# Altium schematic sheet ST1-100-Top.SchDoc: Top
size A3; SheetNumber: 1; SheetTotal: 1
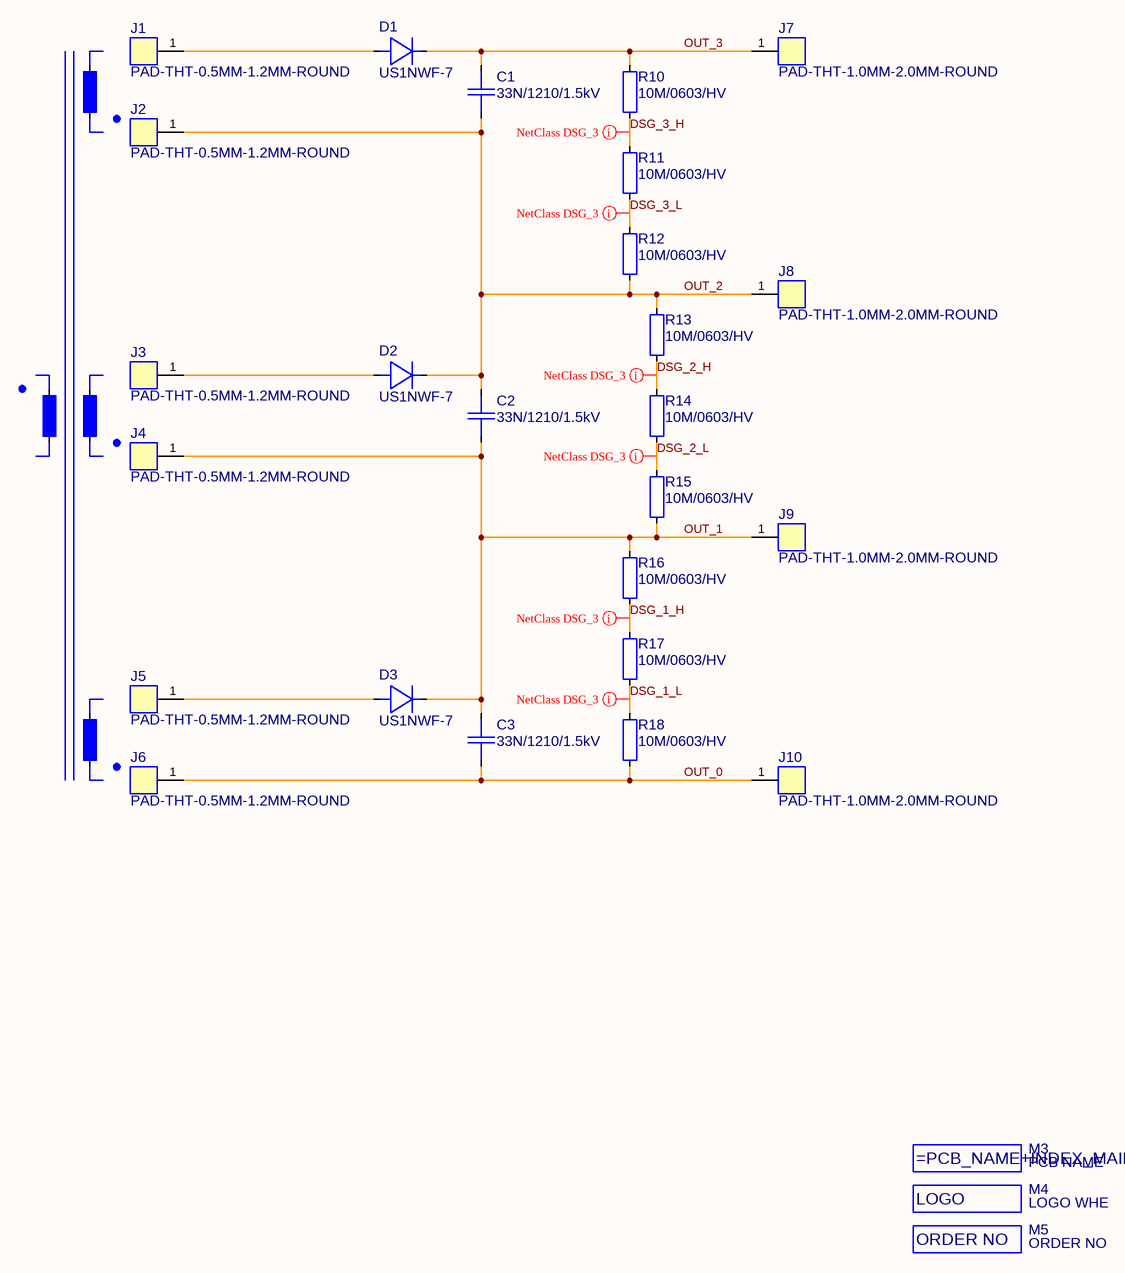
[diagram p0: ST1-100-Top.SchDoc]

## Parts
C1  33N/1210/1.5kV  [CAP1210_X7R]
C2  33N/1210/1.5kV  [CAP1210_X7R]
C3  33N/1210/1.5kV  [CAP1210_X7R]
D1  US1NWF-7  [SOD3718X125]
D2  US1NWF-7  [SOD3718X125]
D3  US1NWF-7  [SOD3718X125]
J1  PAD-THT-0.5MM-1.2MM-ROUND  [PAD-THT-0.5MM-1.2MM-ROUND]
J2  PAD-THT-0.5MM-1.2MM-ROUND  [PAD-THT-0.5MM-1.2MM-ROUND]
J3  PAD-THT-0.5MM-1.2MM-ROUND  [PAD-THT-0.5MM-1.2MM-ROUND]
J4  PAD-THT-0.5MM-1.2MM-ROUND  [PAD-THT-0.5MM-1.2MM-ROUND]
J5  PAD-THT-0.5MM-1.2MM-ROUND  [PAD-THT-0.5MM-1.2MM-ROUND]
J6  PAD-THT-0.5MM-1.2MM-ROUND  [PAD-THT-0.5MM-1.2MM-ROUND]
J7  PAD-THT-1.0MM-2.0MM-ROUND  [PAD-THT-1.0MM-2.0MM-ROUND]
J8  PAD-THT-1.0MM-2.0MM-ROUND  [PAD-THT-1.0MM-2.0MM-ROUND]
J9  PAD-THT-1.0MM-2.0MM-ROUND  [PAD-THT-1.0MM-2.0MM-ROUND]
J10  PAD-THT-1.0MM-2.0MM-ROUND  [PAD-THT-1.0MM-2.0MM-ROUND]
L1  22UH\7643  (value not drawn)  (graphical)
L2  22UH\7643  (value not drawn)  (graphical)
L3  22UH\7643  (value not drawn)  (graphical)
L4  22UH\7643  (value not drawn)  (graphical)
M3  PCB NAME  [PCB-NAME-2MM-CENTER]
M4  LOGO WHE  [LOGO-WHE-2MM]
M5  ORDER NO  [JLC-ORDER]
R10  10M/0603/HV  [R0603-0.40-WW]
R11  10M/0603/HV  [R0603-0.40-WW]
R12  10M/0603/HV  [R0603-0.40-WW]
R13  10M/0603/HV  [R0603-0.40-WW]
R14  10M/0603/HV  [R0603-0.40-WW]
R15  10M/0603/HV  [R0603-0.40-WW]
R16  10M/0603/HV  [R0603-0.40-WW]
R17  10M/0603/HV  [R0603-0.40-WW]
R18  10M/0603/HV  [R0603-0.40-WW]

## Nets
DSG_1_H: R16.2 R17.1
DSG_1_L: R17.2 R18.1
DSG_2_H: R13.2 R14.1
DSG_2_L: R14.2 R15.1
DSG_3_H: R10.2 R11.1
DSG_3_L: R11.2 R12.1
OUT_0: C3.2 J6.1 J10.1 R18.2
OUT_1: C2.2 C3.1 D3.1(C) J4.1 J9.1 R15.2 R16.1
OUT_2: C1.2 C2.1 D2.1(C) J2.1 J8.1 R12.2 R13.1
OUT_3: C1.1 D1.1(C) J7.1 R10.1
NetD1_2: D1.2(A) J1.1
NetD2_2: D2.2(A) J3.1
NetD3_2: D3.2(A) J5.1

Not connected (* = marked no-connect by the designer): L1 1 2; L2 1 2; L3 1 2; L4 1 2

## Layout directives
net class DSG_3: DSG_1_H, DSG_1_L, DSG_2_H, DSG_2_L, DSG_3_H, DSG_3_L

## Notes on the sheet
- Date:
- Size:
- A3
- Schema:
- Layout:

## Library data of the parts
C1-C3 = 33N/1210/1.5kV: CAP SM 1210 33nF 1.5kV; Manufacturer: GENERIC; Manufacturer 1: Cal-Chip Electronics, Inc.; Manufacturer Part Number 1: CHV1210N1K5333KXT; Absolute Value: 3.3E-8; Part Number: 33N/1210/1.5kV; Package: 1210; Value: 33nF; HelpURL: https://88ce57.p3cdn1.secureserver.net/wp-content/uploads/2023/01/chv_series-1.pdf; Supplier 1: Digi-Key; Supplier Part Number 1: 4713-CHV1210N1K5333KXTCT-ND
D1-D3 = US1NWF-7: US1NWF 1.0A SURFACE MOUNT ULTRA-FAST RECTIFIER; Manufacturer: Diodes Incorporated; Absolute Value: 1200V; Part Number: US1NWF-7; Package: SOD-123; Value: US1NWF-7; HelpURL: https://www.diodes.com/assets/Datasheets/US1NWF.pdf; Manufacturer 1: Diodes Incorporated; Manufacturer Part Number 1: US1NWF-7; Supplier 1: Digikey; Supplier Part Number 1: US1NWF-7DICT-ND; Manufacturer 3: DIODES; Manufacturer Part Number 3: US1NWF-7; Supplier 3: LCSC; Supplier Part Number 3: C5148544; JLC Type: Extended
J1-J6 = PAD-THT-0.5MM-1.2MM-ROUND: Through-hole pad, 0.5mm drill, 1.2mm pad, round; Manufacturer: GENERIC; System: Connector; Part Number: PAD-THT-0.5MM-1.2MM-ROUND
J7-J10 = PAD-THT-1.0MM-2.0MM-ROUND: Through-hole pad, 1.0mm drill, 2.0mm pad, round; Manufacturer: GENERIC; System: Connector; Part Number: PAD-THT-1.0MM-2.0MM-ROUND
L1-L4 = 22UH\7643: FIXED IND 22UH 1.75A 92.5MOHM SM
M3 = PCB NAME 2mm C: PCB name, 2mm text height, centered; Manufacturer: NONE; Part Number: PCB NAME 2mm C
M4 = LOGO WHE 2MM: WHE logo, size 2mm; Manufacturer: NONE; Part Number: LOGO WHE 2MM
M5 = ORDER NO JLC: Order number, JLC as per requirement; Manufacturer: NONE; Part Number: ORDER NO JLC
R10-R18 = 10M/0603/HV: RES SM 0603 10M High voltage; Manufacturer: GENERIC; Manufacturer 1: YAGEO; Manufacturer Part Number 1: RV0603FR-0710ML; Absolute Value: 10000000; Part Number: 10M/0603/HV; Package: 0603; Value: 10M; HelpURL: https://www.yageogroup.com/content/datasheet/asset/file/PYU-RV_51_ROHS_L; Supplier 1: Digi-Key; Supplier Part Number 1: 13-RV0603FR-0710MLCT-ND; Manufacturer 3: YAGEO; Manufacturer Part Number 3: RV0603FR-0710ML; Supplier 3: LCSC; Supplier Part Number 3: C873271; JLC Type: Extended